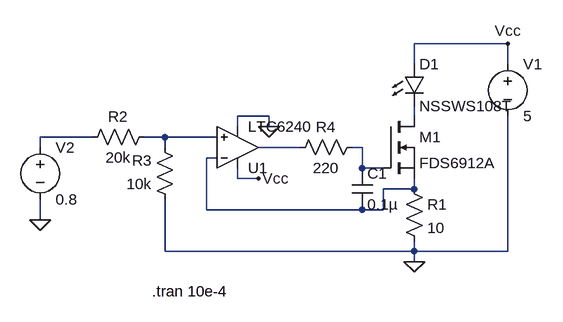
[diagram p0: schematic LED_CurrentDrive.asc]
LED_CurrentDrive.asc, the LTspice schematic file:
Version 4
SHEET 1 880 680
WIRE 304 96 160 96
WIRE 160 128 160 96
WIRE 304 128 304 96
WIRE -64 208 -112 208
WIRE 160 208 160 192
WIRE -112 224 -112 208
WIRE -64 224 -64 208
WIRE -336 240 -416 240
WIRE -224 240 -256 240
WIRE -144 240 -224 240
WIRE -416 256 -416 240
WIRE -224 256 -224 240
WIRE -16 256 -80 256
WIRE 80 256 64 256
WIRE -144 272 -160 272
WIRE 80 288 80 256
WIRE 112 288 80 288
WIRE -112 304 -112 288
WIRE -80 304 -112 304
WIRE 160 320 160 304
WIRE 160 320 112 320
WIRE -160 352 -160 272
WIRE 80 352 -160 352
WIRE 112 352 112 320
WIRE 112 352 80 352
WIRE -416 368 -416 336
WIRE -224 416 -224 336
WIRE 160 416 160 400
WIRE 160 416 -224 416
WIRE 304 416 304 208
WIRE 304 416 160 416
WIRE 160 432 160 416
FLAG -64 224 0
FLAG 160 432 0
FLAG -416 368 0
FLAG 304 96 Vcc
FLAG -80 304 Vcc
SYMBOL voltage 304 112 R0
WINDOW 123 0 0 Left 2
WINDOW 39 0 0 Left 2
SYMATTR InstName V1
SYMATTR Value 5
SYMBOL LED 144 128 R0
SYMATTR InstName D1
SYMATTR Value NSSWS108T
SYMBOL res 144 304 R0
SYMATTR InstName R1
SYMATTR Value 10
SYMBOL nmos 112 208 R0
SYMATTR InstName M1
SYMATTR Value FDS6912A
SYMBOL Opamps\\LTC6240 -112 256 M180
SYMATTR InstName U1
SYMBOL voltage -416 240 R0
WINDOW 123 0 0 Left 2
WINDOW 39 0 0 Left 2
SYMATTR InstName V2
SYMATTR Value 0.8
SYMBOL res -240 224 R90
WINDOW 0 0 56 VBottom 2
WINDOW 3 32 56 VTop 2
SYMATTR InstName R2
SYMATTR Value 20k
SYMBOL res -208 352 R180
WINDOW 0 36 76 Left 2
WINDOW 3 36 40 Left 2
SYMATTR InstName R3
SYMATTR Value 10k
SYMBOL cap 64 288 R0
SYMATTR InstName C1
SYMATTR Value 0.1µ
SYMBOL res 80 240 R90
WINDOW 0 0 56 VBottom 2
WINDOW 3 32 56 VTop 2
SYMATTR InstName R4
SYMATTR Value 220
TEXT -244 478 Left 2 !.tran 10e-4

The netlist it stands for:
* LED_CurrentDrive.asc
V1 Vcc 0 5
D1 Vcc N001 NSSWS108T
R1 N006 0 10
M1 N001 N005 N006 N006 FDS6912A
* U1: LTC6240 (symbol Opamps\LTC6240 not available, pins judged from their places): In+=N003 In-=N006 V+=Vcc V-=0 OUT=N004
V2 N002 0 0.8
R2 N003 N002 20k
R3 0 N003 10k
C1 N005 N006 0.1µ
R4 N005 N004 220
.model D D
.lib standard.dio
.model NMOS NMOS
.model PMOS PMOS
.lib standard.mos
.tran 10e-4
.backanno
.end